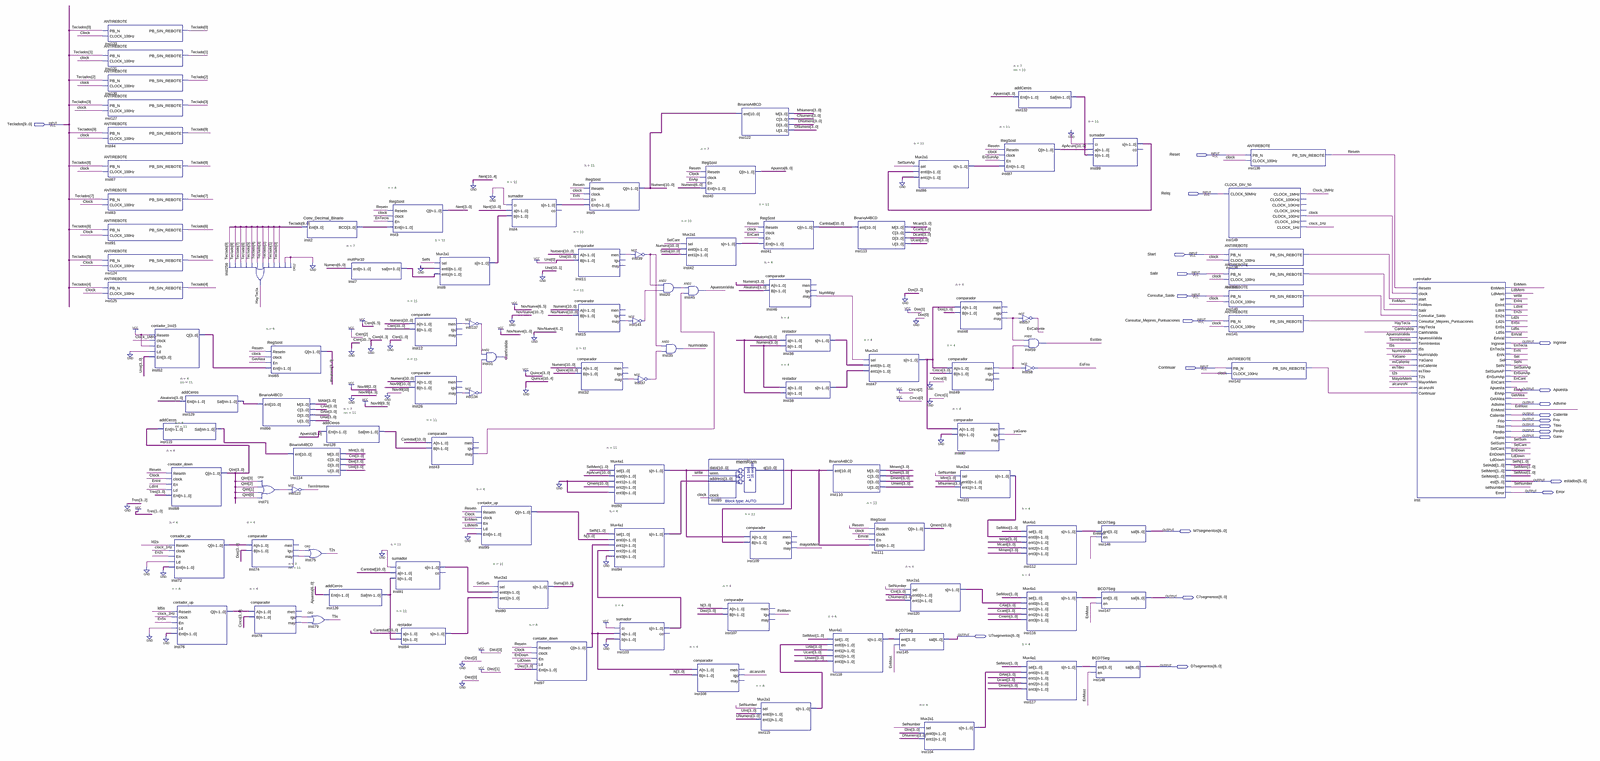
[diagram p0: schematic sheet, whole]
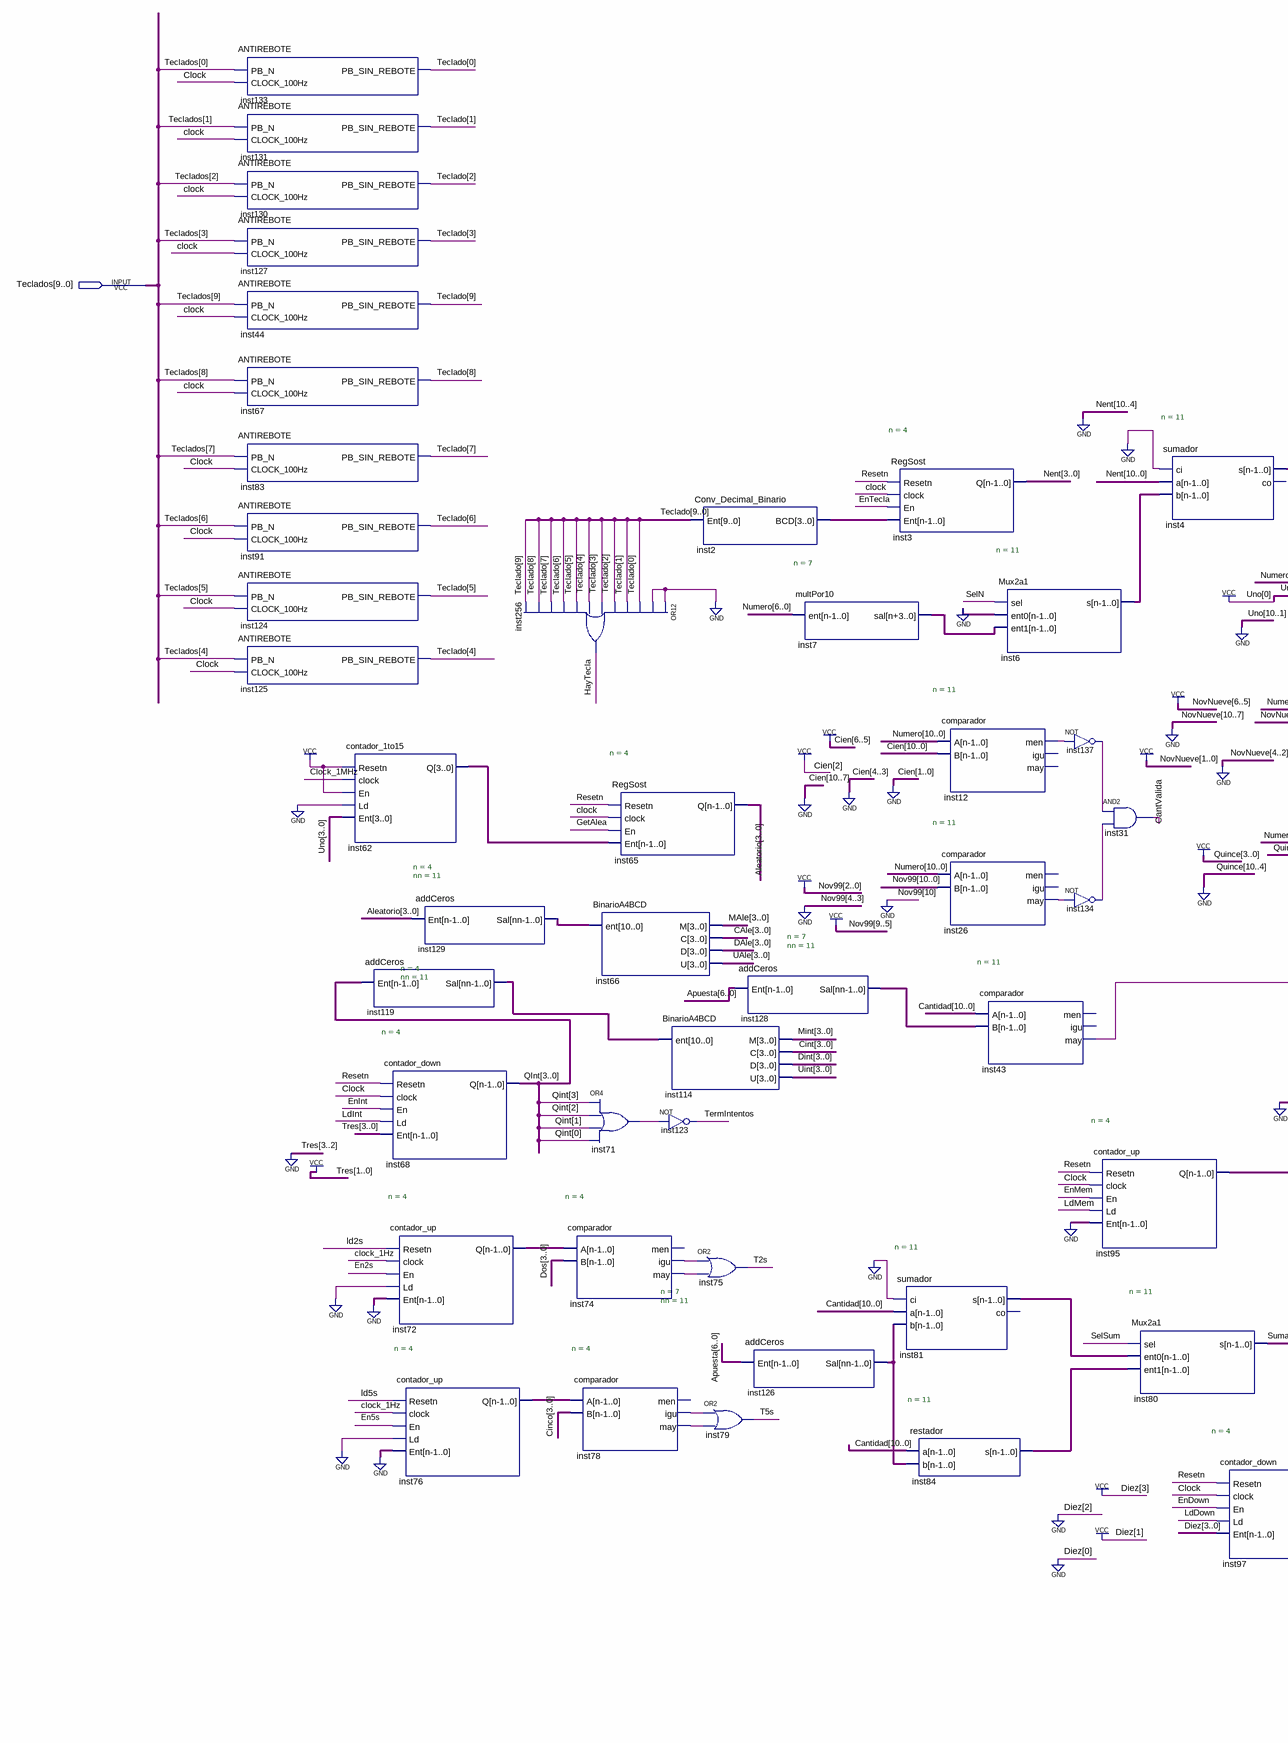
[diagram p1: schematic sheet, left part]
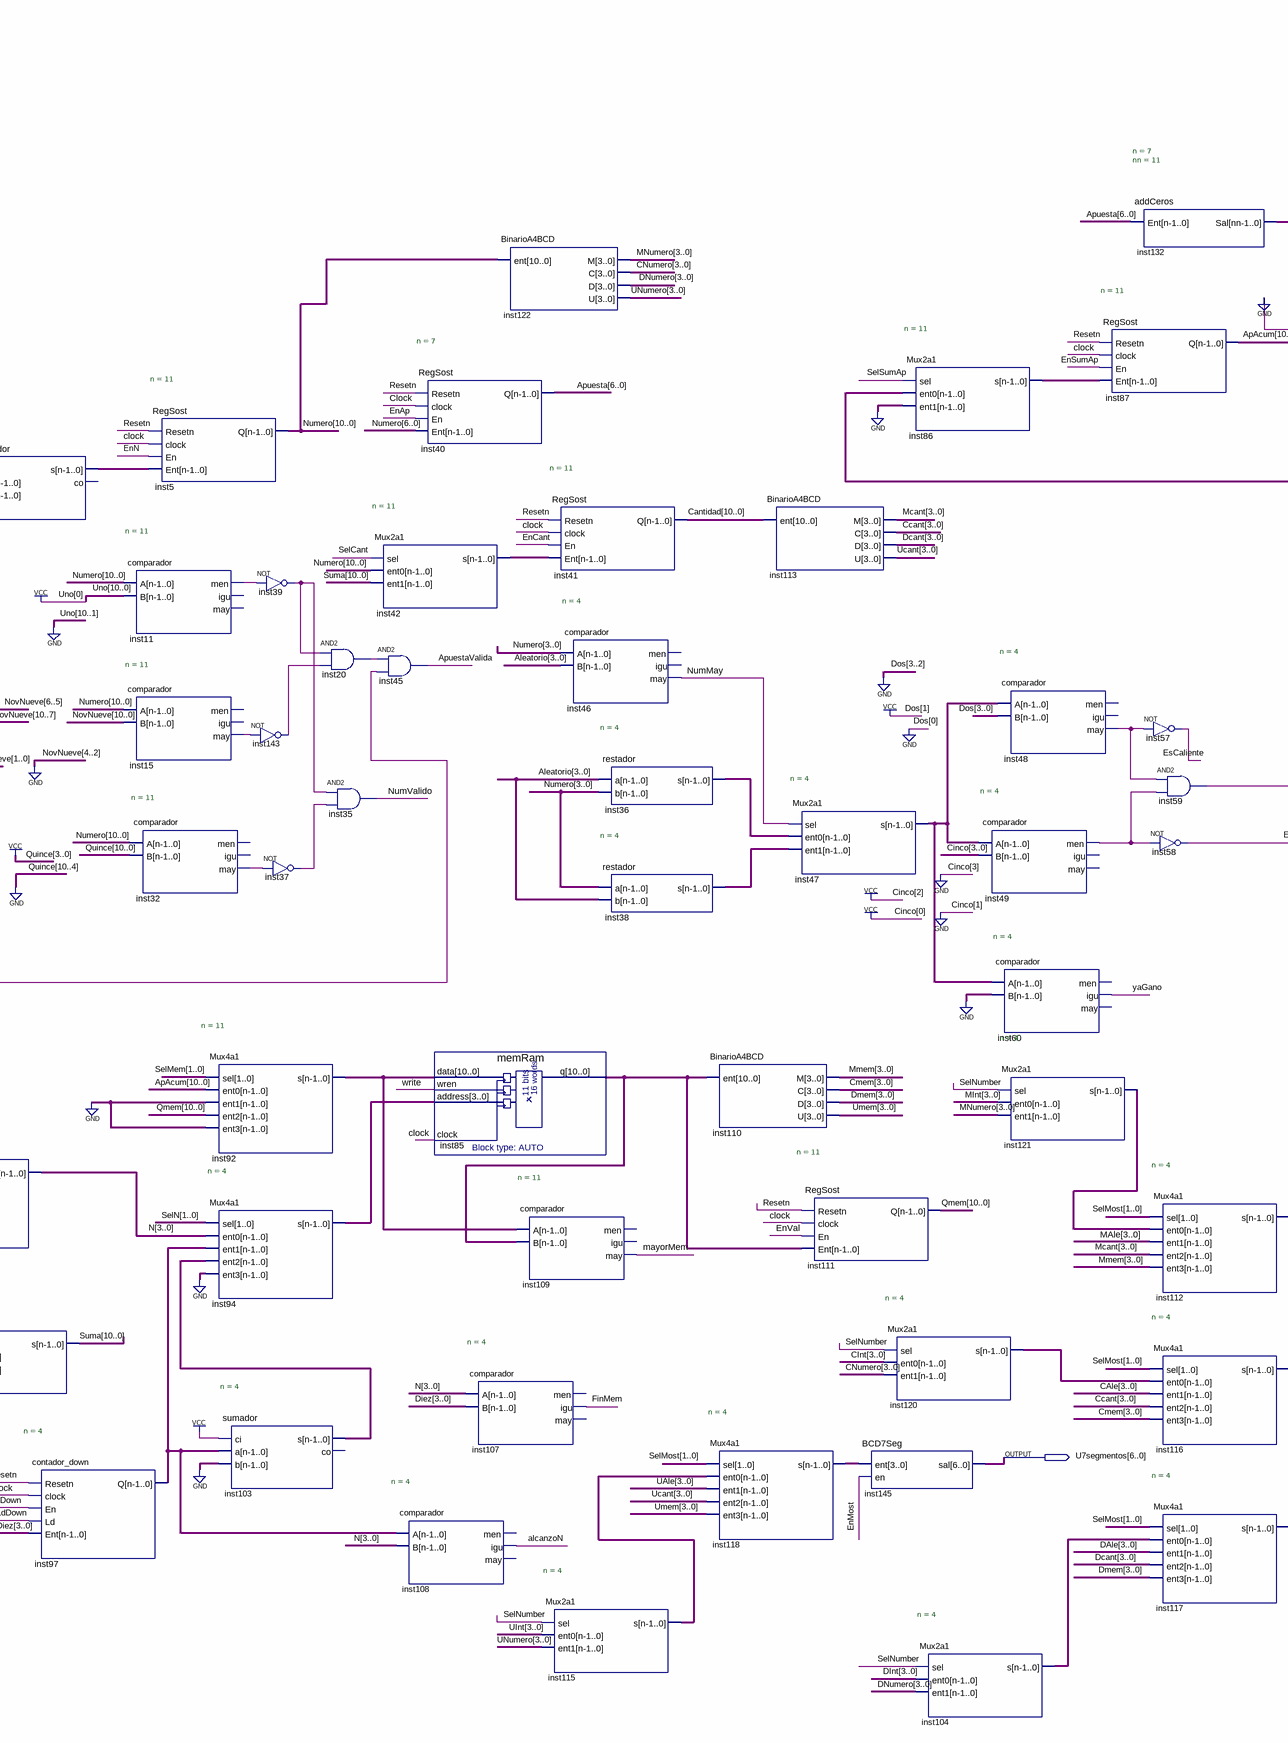
[diagram p2: schematic sheet, centre part]
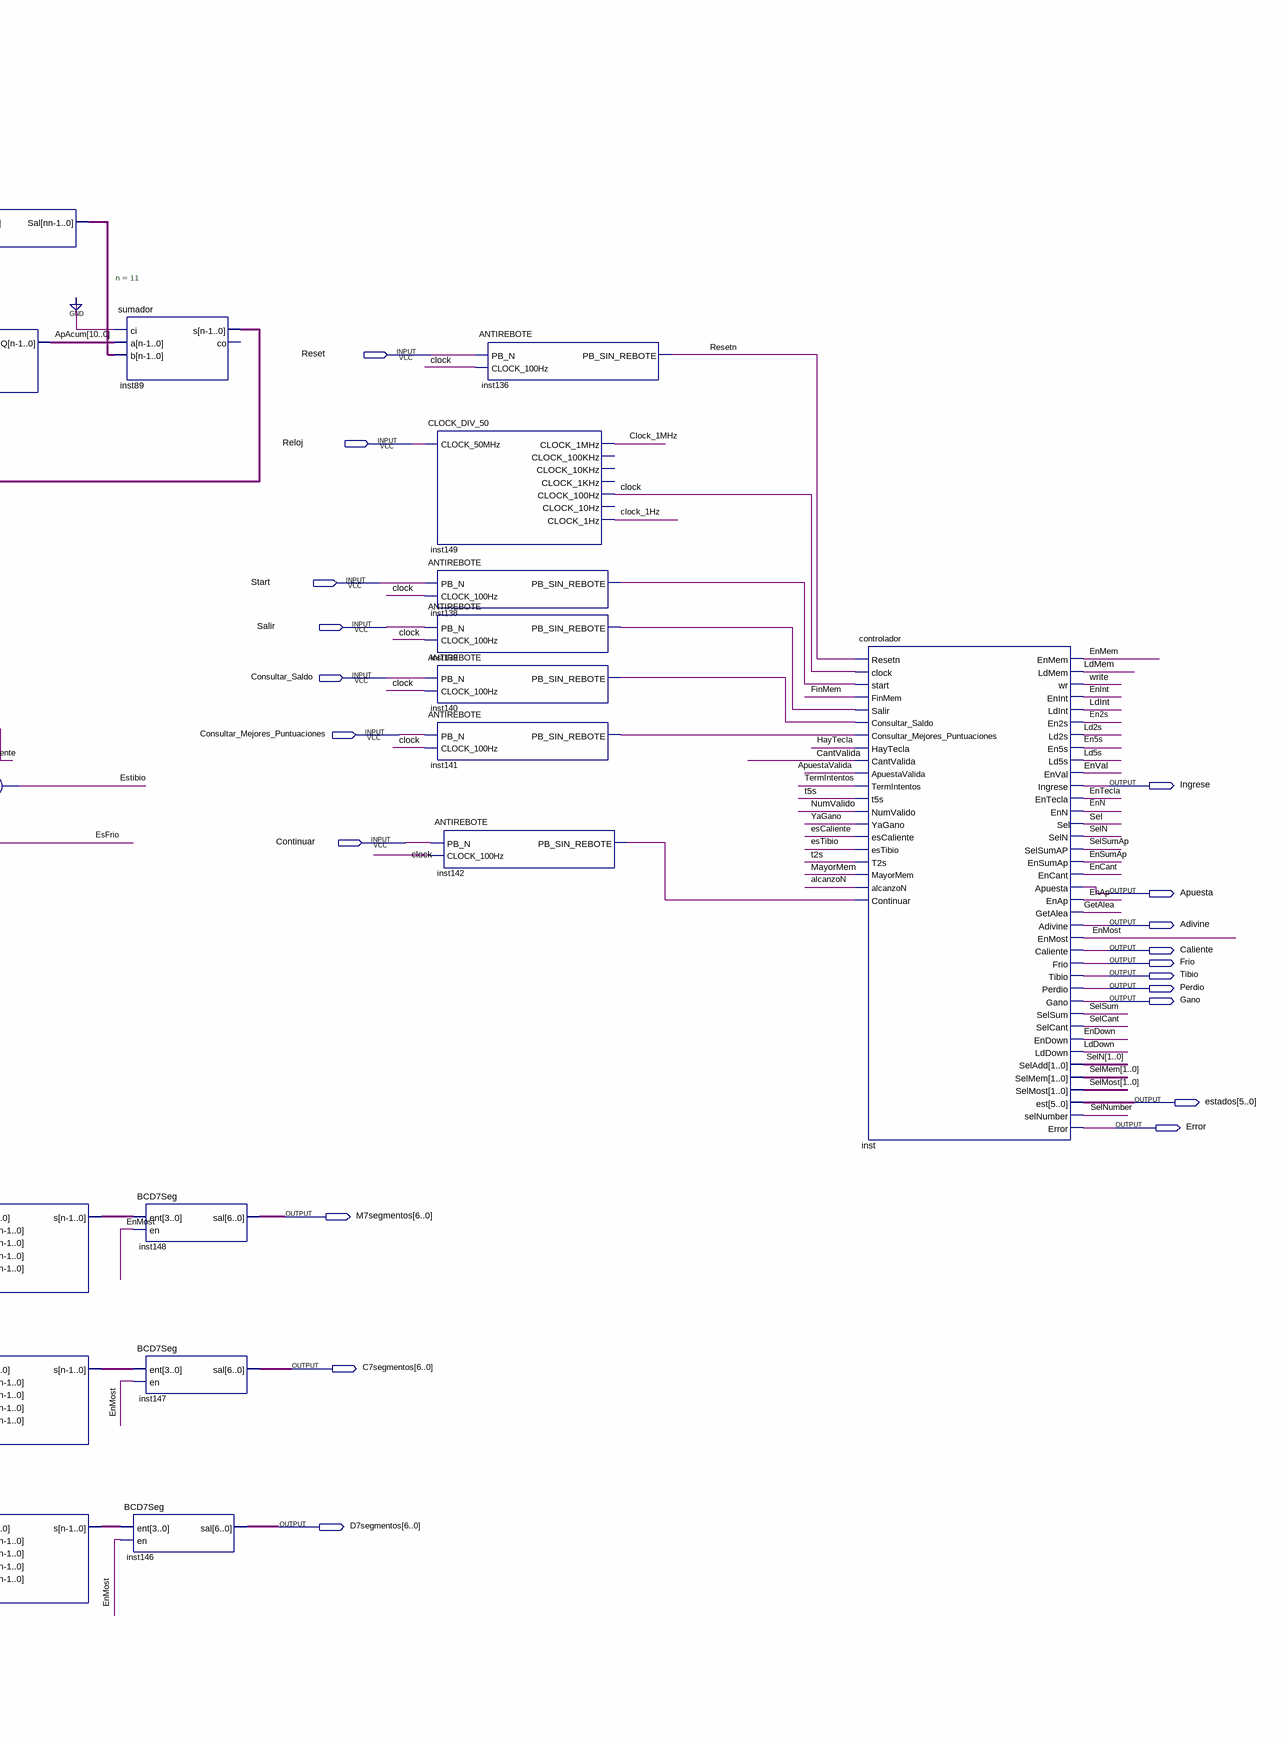
[diagram p3: schematic sheet, right part]
// Quartus schematic Casino.bdf as structural Verilog: 102 symbols, 22 pins
module Casino (
  input  [9:0] Teclados,
  input  Reset,
  input  Reloj,
  input  Start,
  input  Salir,
  input  Consultar_Saldo,
  input  Consultar_Mejores_Puntuaciones,
  input  Continuar,
  output Ingrese,
  output Apuesta,
  output Adivine,
  output Caliente,
  output Frio,
  output Tibio,
  output Perdio,
  output Gano,
  output [5:0] estados,
  output Error,
  output [6:0] M7segmentos,
  output [6:0] C7segmentos,
  output [6:0] U7segmentos,
  output [6:0] D7segmentos
);

  wire alcanzoN, ApuestaValida, CantValida, clock, clock_1Hz, Clock_1MHz, En2s, En5s, EnAp, EnCant, EnDown,
       EnInt, EnMem, EnMost, EnN, EnSumAp, EnTecla, EnVal, EsCaliente, EsFrio, Estibio, FinMem, GetAlea,
       HayTecla, inst11_men, inst12_men, inst15_may, inst20_out, inst26_may, inst32_may, inst37_out,
       inst39_out, inst43_may, inst48_may, inst49_men, inst71_out, inst74_igu, inst74_may, inst78_igu,
       inst78_may, inst134_out, inst137_out, inst138_pb_sin_rebote, inst139_pb_sin_rebote,
       inst140_pb_sin_rebote, inst141_pb_sin_rebote, inst142_pb_sin_rebote, inst143_out, Ld2s, Ld5s, LdDown,
       LdInt, LdMem, mayorMem, NumMay, NumValido, Resetn, Sel, SelCant, SelN_1bit, SelNumber, SelSum,
       SelSumAp, T2s, T5s, TermIntentos, write, yaGano;
  wire [1:0] SelMem, SelMost, SelN;
  wire [3:0] Aleatorio, CAle, Ccant, Cint, Cmem, CNumero, DAle, Dcant, Dint, Dmem, DNumero, inst2_bcd,
       inst36_s, inst38_s, inst47_s, inst62_q, inst72_q, inst76_q, inst94_s, inst97_q, inst103_s, inst104_s,
       inst112_s, inst115_s, inst116_s, inst117_s, inst118_s, inst120_s, inst121_s, MAle, Mcant, Mint, Mmem,
       MNumero, N, Nent, Qint, UAle, Ucant, Uint, Umem, UNumero;
  wire [6:0] Apuesta_bus;
  wire [9:0] Teclado;
  wire [10:0] ApAcum, Cantidad, inst4_s, inst6_s, inst7_sal, inst42_s, inst81_s, inst84_s, inst85_q,
       inst86_s, inst89_s, inst92_s, inst119_sal, inst126_sal, inst128_sal, inst129_sal, inst132_sal, Numero,
       Qmem, Suma;

  ANTIREBOTE inst133 (.PB_N(Teclados[0]), .CLOCK_100Hz(clock), .PB_SIN_REBOTE(Teclado[0]));
  ANTIREBOTE inst131 (.PB_N(Teclados[1]), .CLOCK_100Hz(clock), .PB_SIN_REBOTE(Teclado[1]));
  ANTIREBOTE inst130 (.PB_N(Teclados[2]), .CLOCK_100Hz(clock), .PB_SIN_REBOTE(Teclado[2]));
  ANTIREBOTE inst127 (.PB_N(Teclados[3]), .CLOCK_100Hz(clock), .PB_SIN_REBOTE(Teclado[3]));
  ANTIREBOTE inst44 (.PB_N(Teclados[9]), .CLOCK_100Hz(clock), .PB_SIN_REBOTE(Teclado[9]));
  ANTIREBOTE inst67 (.PB_N(Teclados[8]), .CLOCK_100Hz(clock), .PB_SIN_REBOTE(Teclado[8]));
  ANTIREBOTE inst83 (.PB_N(Teclados[7]), .CLOCK_100Hz(clock), .PB_SIN_REBOTE(Teclado[7]));
  ANTIREBOTE inst91 (.PB_N(Teclados[6]), .CLOCK_100Hz(clock), .PB_SIN_REBOTE(Teclado[6]));
  ANTIREBOTE inst124 (.PB_N(Teclados[5]), .CLOCK_100Hz(clock), .PB_SIN_REBOTE(Teclado[5]));
  ANTIREBOTE inst125 (.PB_N(Teclados[4]), .CLOCK_100Hz(clock), .PB_SIN_REBOTE(Teclado[4]));
  contador_1to15 inst62 (.Resetn(1'b1), .clock(Clock_1MHz), .En(1'b1), .Ld(1'b0), .Ent(4'b0001), .Q(inst62_q));
  addCeros #(.n(4), .nn(11)) inst119 (.Ent(Qint), .Sal(inst119_sal));
  contador_down #(.n(4)) inst68 (.Resetn(Resetn), .clock(clock), .En(EnInt), .Ld(LdInt), .Ent(4'b0011), .Q(Qint));
  contador_up #(.n(4)) inst72 (.Resetn(Ld2s), .clock(clock_1Hz), .En(En2s), .Ld(1'b0), .Ent(4'b0000), .Q(inst72_q));
  addCeros #(.n(4), .nn(11)) inst129 (.Ent(Aleatorio), .Sal(inst129_sal));
  contador_up #(.n(4)) inst76 (.Resetn(Ld5s), .clock(clock_1Hz), .En(En5s), .Ld(1'b0), .Ent(4'b0000), .Q(inst76_q));
  or inst256 (HayTecla, 1'b0, 1'b0, Teclado[0], Teclado[1], Teclado[2], Teclado[3], Teclado[4], Teclado[5], Teclado[6], Teclado[7], Teclado[8], Teclado[9]);
  BinarioA4BCD inst66 (.ent(inst129_sal), .M(MAle), .C(CAle), .D(DAle), .U(UAle));
  or inst71 (inst71_out, Qint[3], Qint[2], Qint[1], Qint[0]);
  comparador #(.n(4)) inst74 (.A(inst72_q), .B(4'b0010), .igu(inst74_igu), .may(inst74_may));  // open: men
  comparador #(.n(4)) inst78 (.A(inst76_q), .B(4'b0101), .igu(inst78_igu), .may(inst78_may));  // open: men
  RegSost #(.n(4)) inst65 (.Resetn(Resetn), .clock(clock), .En(GetAlea), .Ent(inst62_q), .Q(Aleatorio));
  Conv_Decimal_Binario inst2 (.Ent(Teclado), .BCD(inst2_bcd));
  BinarioA4BCD inst114 (.ent(inst119_sal), .M(Mint), .C(Cint), .D(Dint), .U(Uint));
  not inst123 (TermIntentos, inst71_out);
  addCeros #(.n(7), .nn(11)) inst128 (.Ent(Apuesta_bus), .Sal(inst128_sal));
  or inst75 (T2s, inst74_igu, inst74_may);
  addCeros #(.n(7), .nn(11)) inst126 (.Ent(Apuesta_bus), .Sal(inst126_sal));
  or inst79 (T5s, inst78_igu, inst78_may);
  multPor10 #(.n(7)) inst7 (.ent(Numero[6:0]), .sal(inst7_sal));
  RegSost #(.n(4)) inst3 (.Resetn(Resetn), .clock(clock), .En(EnTecla), .Ent(inst2_bcd), .Q(Nent));
  sumador #(.n(11)) inst81 (.ci(1'b0), .a(Cantidad), .b(inst126_sal), .s(inst81_s));  // open: co
  comparador #(.n(11)) inst12 (.A(Numero), .B(11'b00001100100), .men(inst12_men));  // open: igu, may
  comparador #(.n(11)) inst26 (.A(Numero), .B(11'b01111100111), .may(inst26_may));  // open: men, igu
  restador #(.n(11)) inst84 (.a(Cantidad), .b(inst126_sal), .s(inst84_s));
  Mux2a1 #(.n(11)) inst6 (.sel(SelN_1bit), .ent0({11{1'b0}}), .ent1(inst7_sal), .s(inst6_s));
  comparador #(.n(11)) inst43 (.A(Cantidad), .B(inst128_sal), .may(inst43_may));  // open: men, igu
  not inst137 (inst137_out, inst12_men);
  not inst134 (inst134_out, inst26_may);
  contador_up #(.n(4)) inst95 (.Resetn(Resetn), .clock(clock), .En(EnMem), .Ld(LdMem), .Ent(4'b0000), .Q(N));
  and inst31 (CantValida, inst137_out, inst134_out);
  Mux2a1 #(.n(11)) inst80 (.sel(SelSum), .ent0(inst81_s), .ent1(inst84_s), .s(Suma));
  sumador #(.n(11)) inst4 (.ci(1'b0), .a({{7{1'b0}}, Nent}), .b(inst6_s), .s(inst4_s));  // open: co
  contador_down #(.n(4)) inst97 (.Resetn(Resetn), .clock(clock), .En(EnDown), .Ld(LdDown), .Ent(4'b1010), .Q(inst97_q));
  RegSost #(.n(11)) inst5 (.Resetn(Resetn), .clock(clock), .En(EnN), .Ent(inst4_s), .Q(Numero));
  comparador #(.n(11)) inst11 (.A(Numero), .B(11'b00000000001), .men(inst11_men));  // open: igu, may
  comparador #(.n(11)) inst15 (.A(Numero), .B(11'b00001100011), .may(inst15_may));  // open: men, igu
  comparador #(.n(11)) inst32 (.A(Numero), .B(11'b00000001111), .may(inst32_may));  // open: men, igu
  Mux4a1 #(.n(11)) inst92 (
    .sel(SelMem), .ent0(ApAcum), .ent1({11{1'b0}}), .ent2(Qmem), .ent3({11{1'b0}}), .s(inst92_s));
  Mux4a1 #(.n(4)) inst94 (.sel(SelN), .ent0(N), .ent1(inst97_q), .ent2(inst103_s), .ent3(4'b0000), .s(inst94_s));
  not inst39 (inst39_out, inst11_men);
  not inst143 (inst143_out, inst15_may);
  not inst37 (inst37_out, inst32_may);
  sumador #(.n(4)) inst103 (.ci(1'b1), .a(inst97_q), .b(4'b0000), .s(inst103_s));  // open: co
  and inst20 (inst20_out, inst39_out, inst143_out);
  and inst35 (NumValido, inst39_out, inst37_out);
  RegSost #(.n(7)) inst40 (.Resetn(Resetn), .clock(clock), .En(EnAp), .Ent(Numero[6:0]), .Q(Apuesta_bus));
  Mux2a1 #(.n(11)) inst42 (.sel(SelCant), .ent0(Numero), .ent1(Suma), .s(inst42_s));
  and inst45 (ApuestaValida, inst20_out, inst43_may);
  comparador #(.n(4)) inst108 (.A(inst97_q), .B(N), .igu(alcanzoN));  // open: men, may
  memRam inst85 (.data(inst92_s), .wren(write), .address(inst94_s), .clock(clock), .q(inst85_q));
  comparador #(.n(4)) inst107 (.A(N), .B(4'b1010), .igu(FinMem));  // open: men, may
  BinarioA4BCD inst122 (.ent(Numero), .M(MNumero), .C(CNumero), .D(DNumero), .U(UNumero));
  comparador #(.n(11)) inst109 (.A(inst92_s), .B(inst85_q), .may(mayorMem));  // open: men, igu
  RegSost #(.n(11)) inst41 (.Resetn(Resetn), .clock(clock), .En(EnCant), .Ent(inst42_s), .Q(Cantidad));
  comparador #(.n(4)) inst46 (.A(Numero[3:0]), .B(Aleatorio), .may(NumMay));  // open: men, igu
  Mux2a1 #(.n(4)) inst115 (.sel(SelNumber), .ent0(Uint), .ent1(UNumero), .s(inst115_s));
  restador #(.n(4)) inst36 (.a(Aleatorio), .b(Numero[3:0]), .s(inst36_s));
  restador #(.n(4)) inst38 (.a(Numero[3:0]), .b(Aleatorio), .s(inst38_s));
  BinarioA4BCD inst110 (.ent(inst85_q), .M(Mmem), .C(Cmem), .D(Dmem), .U(Umem));
  Mux4a1 #(.n(4)) inst118 (.sel(SelMost), .ent0(inst115_s), .ent1(UAle), .ent2(Ucant), .ent3(Umem), .s(inst118_s));
  BinarioA4BCD inst113 (.ent(Cantidad), .M(Mcant), .C(Ccant), .D(Dcant), .U(Ucant));
  Mux2a1 #(.n(4)) inst47 (.sel(NumMay), .ent0(inst36_s), .ent1(inst38_s), .s(inst47_s));
  RegSost #(.n(11)) inst111 (.Resetn(Resetn), .clock(clock), .En(EnVal), .Ent(inst85_q), .Q(Qmem));
  BCD7Seg inst145 (.ent(inst118_s), .en(EnMost), .sal(U7segmentos));
  Mux2a1 #(.n(11)) inst86 (.sel(SelSumAp), .ent0(inst89_s), .ent1({11{1'b0}}), .s(inst86_s));
  Mux2a1 #(.n(4)) inst120 (.sel(SelNumber), .ent0(Cint), .ent1(CNumero), .s(inst120_s));
  Mux2a1 #(.n(4)) inst104 (.sel(SelNumber), .ent0(Dint), .ent1(DNumero), .s(inst104_s));
  comparador #(.n(4)) inst48 (.A(inst47_s), .B(4'b0010), .may(inst48_may));  // open: men, igu
  comparador #(.n(4)) inst49 (.A(inst47_s), .B(4'b0101), .men(inst49_men));  // open: igu, may
  comparador #(.n(4)) inst60 (.A(inst47_s), .B(4'b0000), .igu(yaGano));  // open: men, may
  Mux2a1 #(.n(4)) inst121 (.sel(SelNumber), .ent0(Mint), .ent1(MNumero), .s(inst121_s));
  RegSost #(.n(11)) inst87 (.Resetn(Resetn), .clock(clock), .En(EnSumAp), .Ent(inst86_s), .Q(ApAcum));
  addCeros #(.n(7), .nn(11)) inst132 (.Ent(Apuesta_bus), .Sal(inst132_sal));
  not inst57 (EsCaliente, inst48_may);
  and inst59 (Estibio, inst48_may, inst49_men);
  not inst58 (EsFrio, inst49_men);
  Mux4a1 #(.n(4)) inst112 (.sel(SelMost), .ent0(inst121_s), .ent1(MAle), .ent2(Mcant), .ent3(Mmem), .s(inst112_s));
  Mux4a1 #(.n(4)) inst116 (.sel(SelMost), .ent0(inst120_s), .ent1(CAle), .ent2(Ccant), .ent3(Cmem), .s(inst116_s));
  Mux4a1 #(.n(4)) inst117 (.sel(SelMost), .ent0(inst104_s), .ent1(DAle), .ent2(Dcant), .ent3(Dmem), .s(inst117_s));
  sumador #(.n(11)) inst89 (.ci(1'b0), .a(ApAcum), .b(inst132_sal), .s(inst89_s));  // open: co
  BCD7Seg inst148 (.ent(inst112_s), .en(EnMost), .sal(M7segmentos));
  BCD7Seg inst147 (.ent(inst116_s), .en(EnMost), .sal(C7segmentos));
  BCD7Seg inst146 (.ent(inst117_s), .en(EnMost), .sal(D7segmentos));
  CLOCK_DIV_50 inst149 (
    .CLOCK_50MHz(Reloj), .CLOCK_1MHz(Clock_1MHz), .CLOCK_100Hz(clock), .CLOCK_1Hz(clock_1Hz));  // open: CLOCK_100KHz, CLOCK_10KHz, CLOCK_1KHz, CLOCK_10Hz
  ANTIREBOTE inst138 (.PB_N(Start), .CLOCK_100Hz(clock), .PB_SIN_REBOTE(inst138_pb_sin_rebote));
  ANTIREBOTE inst139 (.PB_N(Salir), .CLOCK_100Hz(clock), .PB_SIN_REBOTE(inst139_pb_sin_rebote));
  ANTIREBOTE inst140 (.PB_N(Consultar_Saldo), .CLOCK_100Hz(clock), .PB_SIN_REBOTE(inst140_pb_sin_rebote));
  ANTIREBOTE inst141 (
    .PB_N(Consultar_Mejores_Puntuaciones), .CLOCK_100Hz(clock), .PB_SIN_REBOTE(inst141_pb_sin_rebote));
  ANTIREBOTE inst142 (.PB_N(Continuar), .CLOCK_100Hz(clock), .PB_SIN_REBOTE(inst142_pb_sin_rebote));
  ANTIREBOTE inst136 (.PB_N(Reset), .CLOCK_100Hz(clock), .PB_SIN_REBOTE(Resetn));
  controlador inst (
    .Resetn(Resetn), .clock(clock), .start(inst138_pb_sin_rebote), .FinMem(FinMem),
    .Salir(inst139_pb_sin_rebote), .Consultar_Saldo(inst140_pb_sin_rebote),
    .Consultar_Mejores_Puntuaciones(inst141_pb_sin_rebote), .HayTecla(HayTecla), .CantValida(CantValida),
    .ApuestaValida(ApuestaValida), .TermIntentos(TermIntentos), .t5s(T5s), .NumValido(NumValido),
    .YaGano(yaGano), .esCaliente(EsCaliente), .esTibio(Estibio), .T2s(T2s), .MayorMem(mayorMem),
    .alcanzoN(alcanzoN), .Continuar(inst142_pb_sin_rebote), .EnMem(EnMem), .LdMem(LdMem), .wr(write),
    .EnInt(EnInt), .LdInt(LdInt), .En2s(En2s), .Ld2s(Ld2s), .En5s(En5s), .Ld5s(Ld5s), .EnVal(EnVal),
    .Ingrese(Ingrese), .EnTecla(EnTecla), .EnN(EnN), .Sel(Sel), .SelN(SelN_1bit), .SelSumAP(SelSumAp),
    .EnSumAp(EnSumAp), .EnCant(EnCant), .Apuesta(Apuesta), .EnAp(EnAp), .GetAlea(GetAlea), .Adivine(Adivine),
    .EnMost(EnMost), .Caliente(Caliente), .Frio(Frio), .Tibio(Tibio), .Perdio(Perdio), .Gano(Gano),
    .SelSum(SelSum), .SelCant(SelCant), .EnDown(EnDown), .LdDown(LdDown), .SelAdd(SelN), .SelMem(SelMem),
    .SelMost(SelMost), .est(estados), .selNumber(SelNumber), .Error(Error));
endmodule
